# Altium project balanced_detector_v2.PrjPcb
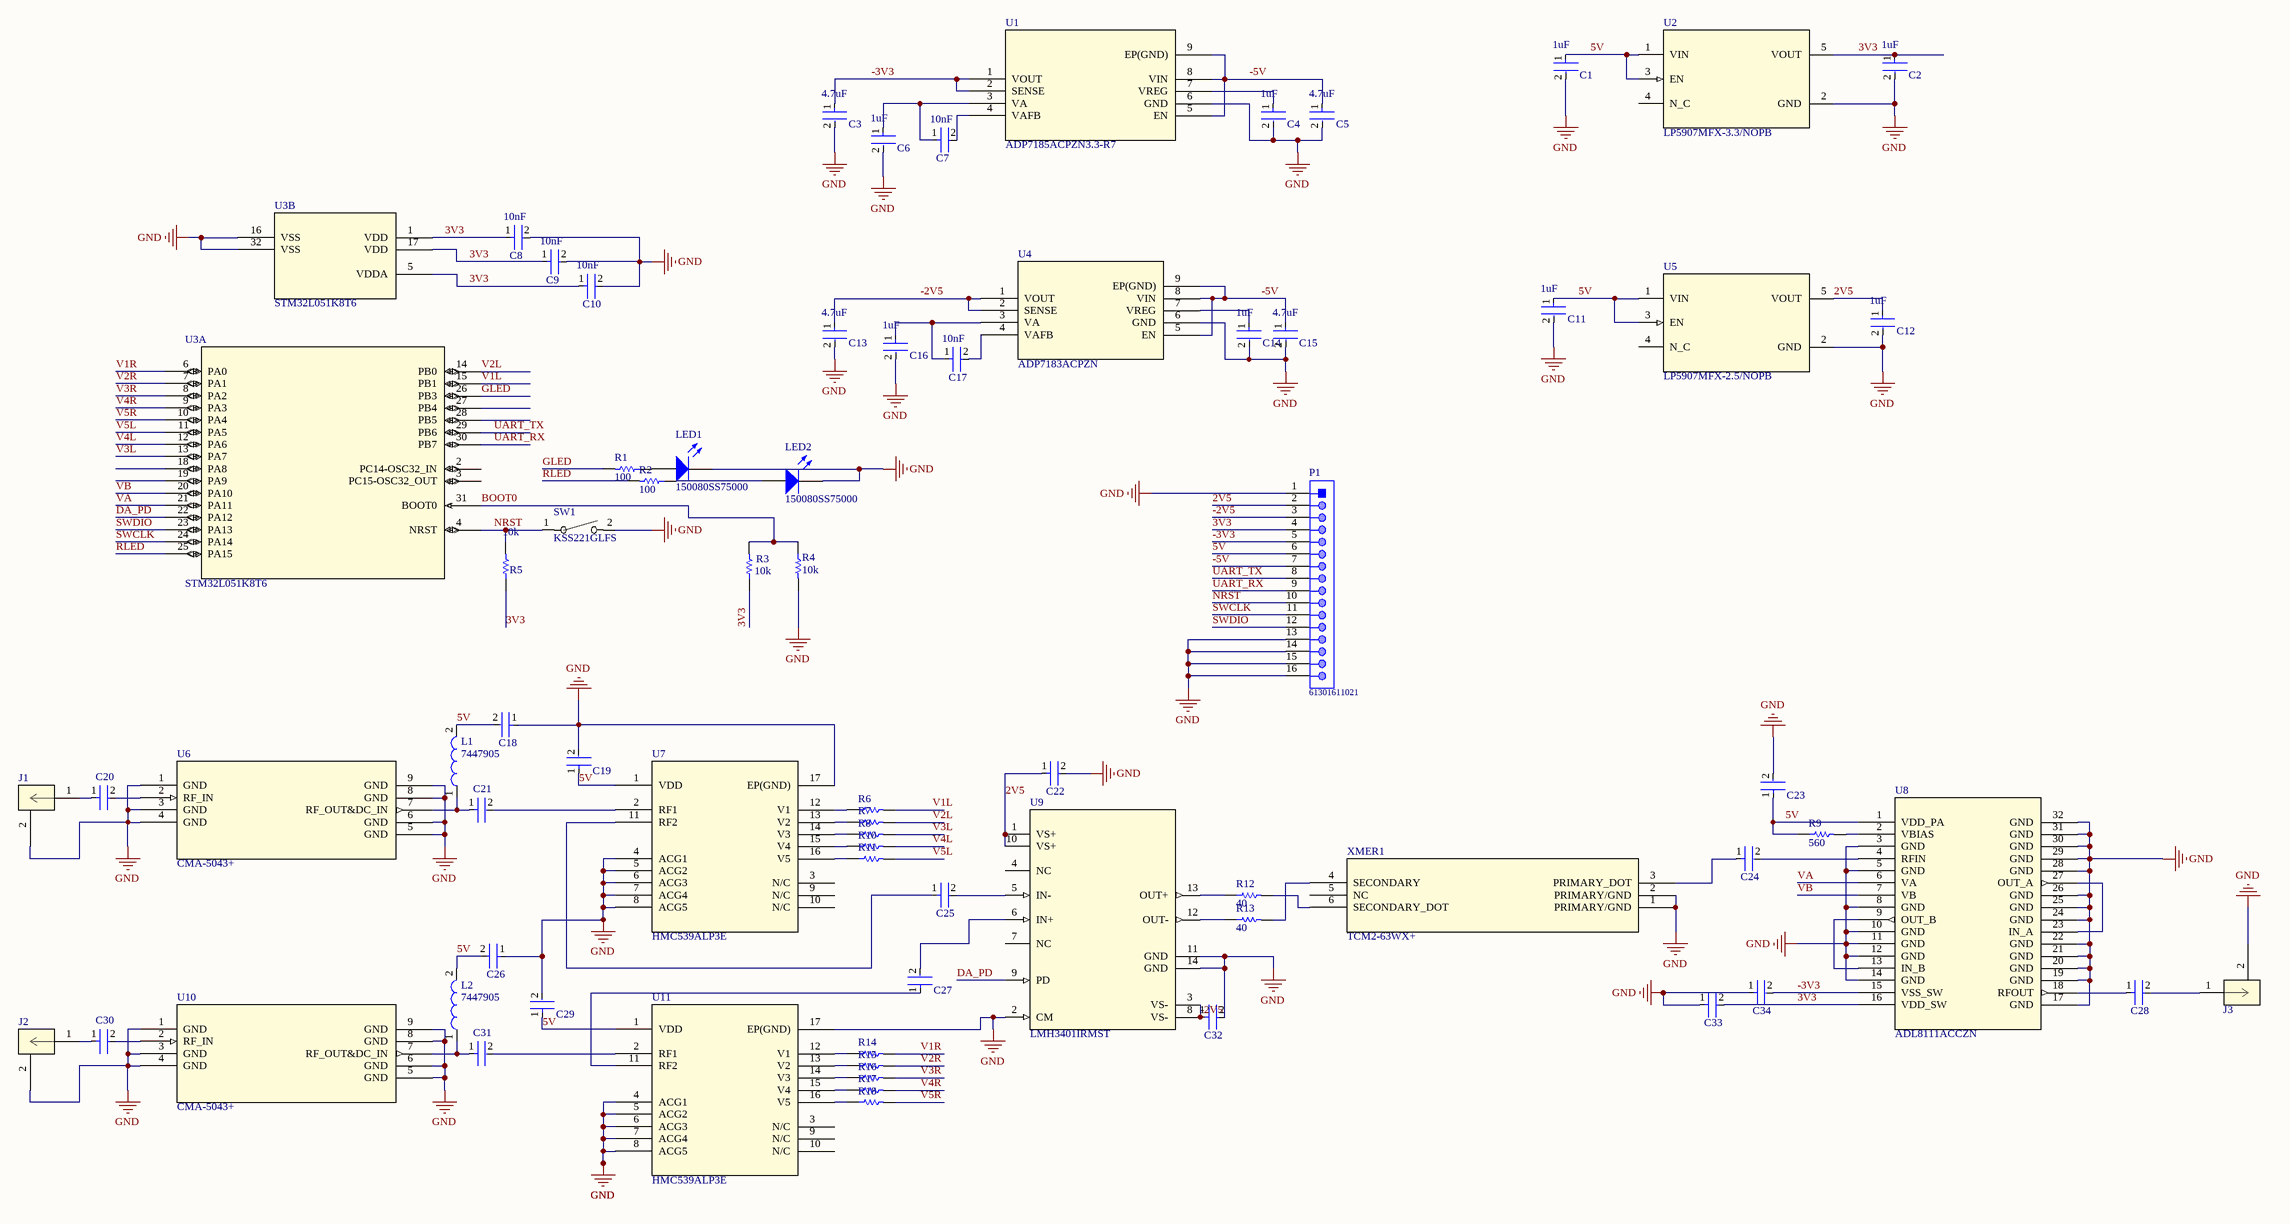
[diagram p0: top_level.SchDoc]
1 sheet, 73 parts. Net scope: global (net labels, ports and power ports of the same name join across sheets).
Board file: top_level.PcbDoc

## Sheet top_level.SchDoc
size A0; SheetNumber: 1; SheetTotal: 1

### Parts
C1  1uF  [FP-C0402-BB-MFG]
C2  1uF  [FP-C0402-BB-MFG]
C3  4.7uF  [FP-C0402-BB-MFG]
C4  1uF  [FP-C0402-BB-MFG]
C5  4.7uF  [FP-C0402-BB-MFG]
C6  1uF  [FP-C0402-BB-MFG]
C7  10nF  [FP-C0402-BB-MFG]
C8  10nF  [FP-C0402-BB-MFG]
C9  10nF  [FP-C0402-BB-MFG]
C10  10nF  [FP-C0402-BB-MFG]
C11  1uF  [FP-C0402-BB-MFG]
C12  1uF  [FP-C0402-BB-MFG]
C13  4.7uF  [FP-C0402-BB-MFG]
C14  1uF  [FP-C0402-BB-MFG]
C15  4.7uF  [FP-C0402-BB-MFG]
C16  1uF  [FP-C0402-BB-MFG]
C17  10nF  [FP-C0402-BB-MFG]
C18  C0402C104K8PACTU  [FP-C0402-BB-MFG]  (value not drawn)
C19  C0402C104K8PACTU  [FP-C0402-BB-MFG]  (value not drawn)
C20  C0402C104K8PACTU  [FP-C0402-BB-MFG]  (value not drawn)
C21  C0402C104K8PACTU  [FP-C0402-BB-MFG]  (value not drawn)
C22  C0402C104K8PACTU  [FP-C0402-BB-MFG]  (value not drawn)
C23  C0402C104K8PACTU  [FP-C0402-BB-MFG]  (value not drawn)
C24  C0402C104K8PACTU  [FP-C0402-BB-MFG]  (value not drawn)
C25  C0402C104K8PACTU  [FP-C0402-BB-MFG]  (value not drawn)
C26  C0402C104K8PACTU  [FP-C0402-BB-MFG]  (value not drawn)
C27  C0402C104K8PACTU  [FP-C0402-BB-MFG]  (value not drawn)
C28  C0402C104K8PACTU  [FP-C0402-BB-MFG]  (value not drawn)
C29  C0402C104K8PACTU  [FP-C0402-BB-MFG]  (value not drawn)
C30  C0402C104K8PACTU  [FP-C0402-BB-MFG]  (value not drawn)
C31  C0402C104K8PACTU  [FP-C0402-BB-MFG]  (value not drawn)
C32  C0402C104K8PACTU  [FP-C0402-BB-MFG]  (value not drawn)
C33  C0402C104K8PACTU  [FP-C0402-BB-MFG]  (value not drawn)
C34  C0402C104K8PACTU  [FP-C0402-BB-MFG]  (value not drawn)
J1  142-0711-821  [CONN_142-0711-821_CIN]  (value not drawn)
J2  142-0711-821  [CONN_142-0711-821_CIN]  (value not drawn)
J3  142-0711-821  [CONN_142-0711-821_CIN]  (value not drawn)
L1  7447905  [SMD-0805]
L2  7447905  [SMD-0805]
LED1  150080SS75000  [0805_A]
LED2  150080SS75000  [0805_A]
P1  61301611021  [61301611021]
R1  100  [RESC1005X40X25NL05T10]
R2  100  [RESC1005X40X25NL05T10]
R3  10k  [RESC1005X40X25NL05T10]
R4  10k  [RESC1005X40X25NL05T10]
R5  10k  [RESC1005X40X25NL05T10]
R6  RC0402JR-070RL  [RESC1005X40X25NL05T10]  (value not drawn)
R7  RC0402JR-070RL  [RESC1005X40X25NL05T10]  (value not drawn)
R8  RC0402JR-070RL  [RESC1005X40X25NL05T10]  (value not drawn)
R9  560  [RESC1005X40X25NL05T10]
R10  RC0402JR-070RL  [RESC1005X40X25NL05T10]  (value not drawn)
R11  RC0402JR-070RL  [RESC1005X40X25NL05T10]  (value not drawn)
R12  40  [RESC1005X40X25NL05T10]
R13  40  [RESC1005X40X25NL05T10]
R14  RC0402JR-070RL  [RESC1005X40X25NL05T10]  (value not drawn)
R15  RC0402JR-070RL  [RESC1005X40X25NL05T10]  (value not drawn)
R16  RC0402JR-070RL  [RESC1005X40X25NL05T10]  (value not drawn)
R17  RC0402JR-070RL  [RESC1005X40X25NL05T10]  (value not drawn)
R18  RC0402JR-070RL  [RESC1005X40X25NL05T10]  (value not drawn)
SW1  KSS221GLFS  [SW_KSS221GLFS_CNK]
U1  ADP7185ACPZN3.3-R7  [CP_8_27_ADI]
U2  LP5907MFX-3.3/NOPB  [DBV0005A_L]
U3  STM32L051K8T6  [LQFP32_7X7X1P4]  (parts A,B of 2)
U4  ADP7183ACPZN  [CP-8-27_ADI]
U5  LP5907MFX-2.5/NOPB  [DBV0005A_L]
U6  CMA-5043+  [DL1721_MNC]
U7  HMC539ALP3E  [HCP_16_1_ADI]
U8  ADL8111ACCZN  [IC28_ADL8111ACCZN_ADI]
U9  LMH3401IRMST  [RMS0014A]
U10  CMA-5043+  [DL1721_MNC]
U11  HMC539ALP3E  [HCP_16_1_ADI]
XMER1  TCM2-63WX+  [DB1627_MNC]

### Nets
GND: C1.2 C2.2 C3.2 C4.2 C5.2 C6.2 C8.2 C9.2 C10.2 C11.2 C12.2 C13.2 C14.2 C15.2 C16.2 C18.1 C19.2 C22.2 C23.2 C26.1 C29.2 C32.2 C33.1 C34.1 J1.2 J2.2 J3.2 LED1.1(K) LED2.1(K) P1.1 P1.13 P1.14 P1.15 P1.16 R4.2 SW1.2 U1.6(GND) U2.2(GND) U3.16(VSS) U3.32(VSS) U4.6(GND) U5.2(GND) U6.1(GND) U6.3(GND) U6.4(GND) U6.5(GND) U6.6(GND) U6.8(GND) U6.9(GND) U7.4(ACG1) U7.5(ACG2) U7.6(ACG3) U7.7(ACG4) U7.8(ACG5) U7.17(EP(GND)) U8.3(GND) U8.5(GND) U8.8(GND) U8.10(GND) U8.11(GND) U8.12(GND) U8.14(GND) U8.17(GND) U8.19(GND) U8.20(GND) U8.21(GND) U8.22(GND) U8.24(GND) U8.25(GND) U8.26(GND) U8.28(GND) U8.29(GND) U8.30(GND) U8.31(GND) U8.32(GND) U9.2(CM) U9.11(GND) U9.14(GND) U10.1(GND) U10.3(GND) U10.4(GND) U10.5(GND) U10.6(GND) U10.8(GND) U10.9(GND) U11.4(ACG1) U11.5(ACG2) U11.6(ACG3) U11.7(ACG4) U11.8(ACG5) U11.17(EP(GND)) XMER1.1(PRIMARY/GND) XMER1.2(PRIMARY/GND)
2V5: C12.1 C22.1 P1.2 U5.5(VOUT) U9.1(VS+) U9.10(VS+)
3V3: C2.1 C8.1 C9.1 C10.1 C33.2 P1.4 R3.1 R5.1 U2.5(VOUT) U3.1(VDD) U3.5(VDDA) U3.17(VDD) U8.16(VDD_SW)
5V: C1.1 C11.1 C18.2 C19.1 C23.1 C26.2 C29.1 L1.2 L2.2 P1.6 R9.1 U2.1(VIN) U2.3(EN) U5.1(VIN) U5.3(EN) U7.1(VDD) U8.1(VDD_PA) U11.1(VDD)
-2V5: C13.1 C32.1 P1.3 U4.1(VOUT) U4.2(SENSE) U9.3(VS-) U9.8(VS-)
-3V3: C3.1 C34.2 P1.5 U1.1(VOUT) U1.2(SENSE) U8.15(VSS_SW)
-5V: C5.1 C15.1 P1.7 U1.5(EN) U1.8(VIN) U1.9(EP(GND)) U4.5(EN) U4.8(VIN) U4.9(EP(GND))
BOOT0: R3.2 R4.1 U3.31(BOOT0)
DA_PD: U3.22(PA12) U9.9(PD)
GLED: R1.2 U3.26(PB3)
NRST: P1.10 R5.2 SW1.1 U3.4(NRST)
RLED: R2.2 U3.25(PA15)
SWCLK: P1.11 U3.24(PA14)
SWDIO: P1.12 U3.23(PA13)
UART_RX: P1.9 U3.30(PB7)
UART_TX: P1.8 U3.29(PB6)
V1L: R6.2 U3.15(PB1)
V1R: R14.2 U3.6(PA0)
V2L: R7.2 U3.14(PB0)
V2R: R15.2 U3.7(PA1)
V3L: R8.2 U3.13(PA7)
V3R: R16.2 U3.8(PA2)
V4L: R10.2 U3.12(PA6)
V4R: R17.2 U3.9(PA3)
V5L: R11.2 U3.11(PA5)
V5R: R18.2 U3.10(PA4)
VA: U3.21(PA11) U8.6(VA)
VB: U3.20(PA10) U8.7(VB)
NetC4_1: C4.1 U1.7(VREG)
NetC6_1: C6.1 C7.1 U1.3(VA)
NetC7_2: C7.2 U1.4(VAFB)
NetC14_1: C14.1 U4.7(VREG)
NetC16_1: C16.1 C17.1 U4.3(VA)
NetC17_2: C17.2 U4.4(VAFB)
NetC20_1: C20.1 J1.1
NetC20_2: C20.2 U6.2(RF_IN)
NetC21_1: C21.1 L1.1 U6.7(RF_OUT&DC_IN)
NetC21_2: C21.2 U7.2(RF1)
NetC24_1: C24.1 XMER1.3(PRIMARY_DOT)
NetC24_2: C24.2 U8.4(RFIN)
NetC25_1: C25.1 U7.11(RF2)
NetC25_2: C25.2 U9.5(IN-)
NetC27_1: C27.1 U11.11(RF2)
NetC27_2: C27.2 U9.6(IN+)
NetC28_1: C28.1 U8.18(RFOUT)
NetC28_2: C28.2 J3.1
NetC30_1: C30.1 J2.1
NetC30_2: C30.2 U10.2(RF_IN)
NetC31_1: C31.1 L2.1 U10.7(RF_OUT&DC_IN)
NetC31_2: C31.2 U11.2(RF1)
NetLED1_2: LED1.2(A) R1.1
NetLED2_2: LED2.2(A) R2.1
NetR6_1: R6.1 U7.12(V1)
NetR7_1: R7.1 U7.13(V2)
NetR8_1: R8.1 U7.14(V3)
NetR9_2: R9.2 U8.2(VBIAS)
NetR10_1: R10.1 U7.15(V4)
NetR11_1: R11.1 U7.16(V5)
NetR12_1: R12.1 U9.13(OUT+)
NetR12_2: R12.2 XMER1.6(SECONDARY_DOT)
NetR13_1: R13.1 U9.12(OUT-)
NetR13_2: R13.2 XMER1.4(SECONDARY)
NetR14_1: R14.1 U11.12(V1)
NetR15_1: R15.1 U11.13(V2)
NetR16_1: R16.1 U11.14(V3)
NetR17_1: R17.1 U11.15(V4)
NetR18_1: R18.1 U11.16(V5)
NetU8_9: U8.9(OUT_B) U8.13(IN_B)
NetU8_23: U8.23(IN_A) U8.27(OUT_A)

Not connected (* = marked no-connect by the designer): U2 4(N_C); U3 2(PC14-OSC32_IN) 3(PC15-OSC32_OUT) 18(PA8) 19(PA9) 27(PB4) 28(PB5); U5 4(N_C); U7 3(N/C) 9(N/C) 10(N/C); U9 4(NC) 7(NC); U11 3(N/C) 9(N/C) 10(N/C); XMER1 5(NC)

### Library data of the parts
C1-C17 = CMP-2008-02046-2: CAP CER 0.1UF 10V X5R 0402; Manufacturer: Kemet; Manufacturer Part Number: C0402C104K8PACTU; Material: Ceramic; Capacitance: 0.10 μF; Temperature Coefficient: 15%; Tolerance: 0.1; Value: 0.10 μF; Package: C0402-BB; Temperature: -55°C to +125°C; ComponentLink2Description: Datasheet; Temperature Characteristic: X5R; Device Class L1: Passive Components; Height: 0.55mm; Lead Free: Yes; ComponentLink2URL: https://content.kemet.com/datasheets/KEM_C1002_X7R_SMD.pdf; Device Class L2: Capacitors; Temperature Range Low: -55°C; Temperature Range High: +125°C; RoHS: TRUE; Octopart: https://octopart.com/c0402c104k8pactu-kemet-140039; Automotive: No; Mouser Description: Capacitor 100 nF 10 VDC 0402; Category: Cap; Voltage Rating: 10 V; Digikey Description: CAP CER 0.1UF 10V X5R 0402; Ipc Land Pattern Name: CAPC10050X50; Device Class L3: Ceramic Capacitors
C18-C34 = CMP-2008-02046-2: CAP CER 0.1UF 10V X5R 0402; Manufacturer: Kemet; Material: Ceramic; Capacitance: 0.10 μF; Temperature Coefficient: 15%; Tolerance: 0.1; Value: 0.10 μF; Package: C0402-BB; Temperature: -55°C to +125°C; ComponentLink2Description: Datasheet; Temperature Characteristic: X5R; Device Class L1: Passive Components; Height: 0.55mm; Lead Free: Yes; ComponentLink2URL: https://content.kemet.com/datasheets/KEM_C1002_X7R_SMD.pdf; Device Class L2: Capacitors; Temperature Range Low: -55°C; Temperature Range High: +125°C; RoHS: TRUE; Octopart: https://octopart.com/c0402c104k8pactu-kemet-140039; Automotive: No; Mouser Description: Capacitor 100 nF 10 VDC 0402; Category: Cap; Voltage Rating: 10 V; Digikey Description: CAP CER 0.1UF 10V X5R 0402; Ipc Land Pattern Name: CAPC10050X50; Device Class L3: Ceramic Capacitors; Manufacturer Part Number: C0402C104K8PACTU
J1-J3 = 142-0711-821: No Description Available; Mfr_Name: Cinch Connectivity Solutions; Copyright: Copyright (C) 2022 Ultra Librarian. All rights reserved.; Manufacturer_Part_Number: 142-0711-821; RefDes: RefDes; Type: DEV
L1 L2 = CMP-0221-00012-1: SMD-Multilayer Inductor WE-MI, L = 1.00 µH; Inductance: 1.00 ÂµH; ComponentLink2URL: http://www.we-online.de/katalog/media/pdf/7447905.pdf; ComponentLink1Description: Manufacturer Link; ComponentLink2Description: Datasheet; DatasheetVersion: ver 4, Oct-2004; PackageVersion: 2005; PackageReference: SMD-0805; ComponentLink1URL: http://www.we-online.com; PackageDescription: Chip Inductor, 2-Leads, Body 2.0 x 1.2 mm
LED1 LED2 = CMP-1426-00010-1: SMD mono-color Chip LED, WL-SMCW, Super Red; Manufacturer: Wuerth Elektronik; PackageReference: 0805_A; ComponentLink2URL: http://katalog.we-online.com/led/datasheet/150080SS75000.pdf; ComponentLink1URL: http://www.we-online.com; Color: Super Red; ComponentLink2Description: Datasheet; ComponentLink1Description: Manufacturer URL; PartNumber: 150080SS75000
P1 = CMP-1502-01094-1: THT Angled Pin Header WR-PHD, Pitch 2.54 mm, Single Row, 16 pins; Manufacturer: Wurth Elektronik; Contact Resistance: 20mOhm; Working Voltage: 250VAC; Pitch: 2.54mm; Rated Current: 3A; Withstanding Voltage: 500VAC; Pin Number: 16; Gender: Male; Package Reference: 61301611021; Datasheet URL: https://katalog.we-online.de/em/datasheet/6130xx11021.pdf; Manufacturer URL: http://www.we-online.de; Packaging: Bag; Part Number: 61301611021; Operating Temperature: -40to105degC; Row Number: Single; Orientation: Angled; Mounting Technology: THT; Publisher: WurthElektronik
R1-R5 R9 R12 R13 = CMP-1011-00001-2: Manufacturer: Yageo / Phycomp; Part Number: RC0402JR-070RL
R6-R8 R10 R11 R14-R18 = CMP-1011-00001-2: Manufacturer: Yageo / Phycomp; Part Number: RC0402JR-070RL
SW1 = KSS221GLFS: No Description Available; Mfr_Name: C&K; Copyright: Copyright (C) 2022 Ultra Librarian. All rights reserved.; Manufacturer_Part_Number: KSS221GLFS; RefDes: RefDes; Type: DEV
U1 = ADP7185ACPZN3.3-R7: No Description Available; Mfr_Name: Analog Devices Inc; Copyright: Copyright (C) 2022 Ultra Librarian. All rights reserved.; Manufacturer_Part_Number: ADP7185ACPZN3.3-R7; RefDes: RefDes; Type: DEV
U2 = LP5907MFX-3.3/NOPB: No Description Available; Mfr_Name: Texas Instruments; Type: DEV; RefDes: RefDes; Copyright: Copyright (C) 2022 Ultra Librarian. All rights reserved.; Manufacturer_Part_Number: LP5907MFX-3.3/NOPB
U3 = STM32L051K8T6: No Description Available; Mfr_Name: STMicroelectronics; Copyright: Copyright (C) 2022 Ultra Librarian. All rights reserved.; Manufacturer_Part_Number: STM32L051K8T6; RefDes: RefDes; Type: DEV
U4 = ADP7183ACPZN: No Description Available; Mfr_Name: Analog Devices Inc; Copyright: Copyright (C) 2022 Ultra Librarian. All rights reserved.; Manufacturer_Part_Number: ADP7183ACPZN; RefDes: RefDes; Type: DEV
U5 = LP5907MFX-2.5/NOPB: No Description Available; Mfr_Name: Texas Instruments; Type: DEV; RefDes: RefDes; Copyright: Copyright (C) 2022 Ultra Librarian. All rights reserved.; Manufacturer_Part_Number: LP5907MFX-2.5/NOPB
U6 U10 = CMA-5043+: No Description Available; Mfr_Name: Mini Circuits; Copyright: Copyright (C) 2022 Ultra Librarian. All rights reserved.; Manufacturer_Part_Number: CMA-5043+; RefDes: RefDes; Type: DEV
U7 U11 = HMC539ALP3E: No Description Available; Mfr_Name: Analog Devices Inc; Copyright: Copyright (C) 2022 Ultra Librarian. All rights reserved.; Manufacturer_Part_Number: HMC539ALP3E; RefDes: RefDes; Type: DEV
U8 = ADL8111ACCZN: No Description Available; Mfr_Name: Analog Devices Inc; Copyright: Copyright (C) 2022 Ultra Librarian. All rights reserved.; Manufacturer_Part_Number: ADL8111ACCZN; RefDes: RefDes; Type: DEV
U9 = LMH3401IRMST: No Description Available; Mfr_Name: Texas Instruments; Type: DEV; RefDes: RefDes; Copyright: Copyright (C) 2022 Ultra Librarian. All rights reserved.; Manufacturer_Part_Number: LMH3401IRMST
XMER1 = TCM2-63WX+: No Description Available; Mfr_Name: Mini Circuits; Copyright: Copyright (C) 2022 Ultra Librarian. All rights reserved.; Manufacturer_Part_Number: TCM2-63WX+; RefDes: RefDes; Type: DEV